# EAGLE design board (EAGLE 9.0.0)
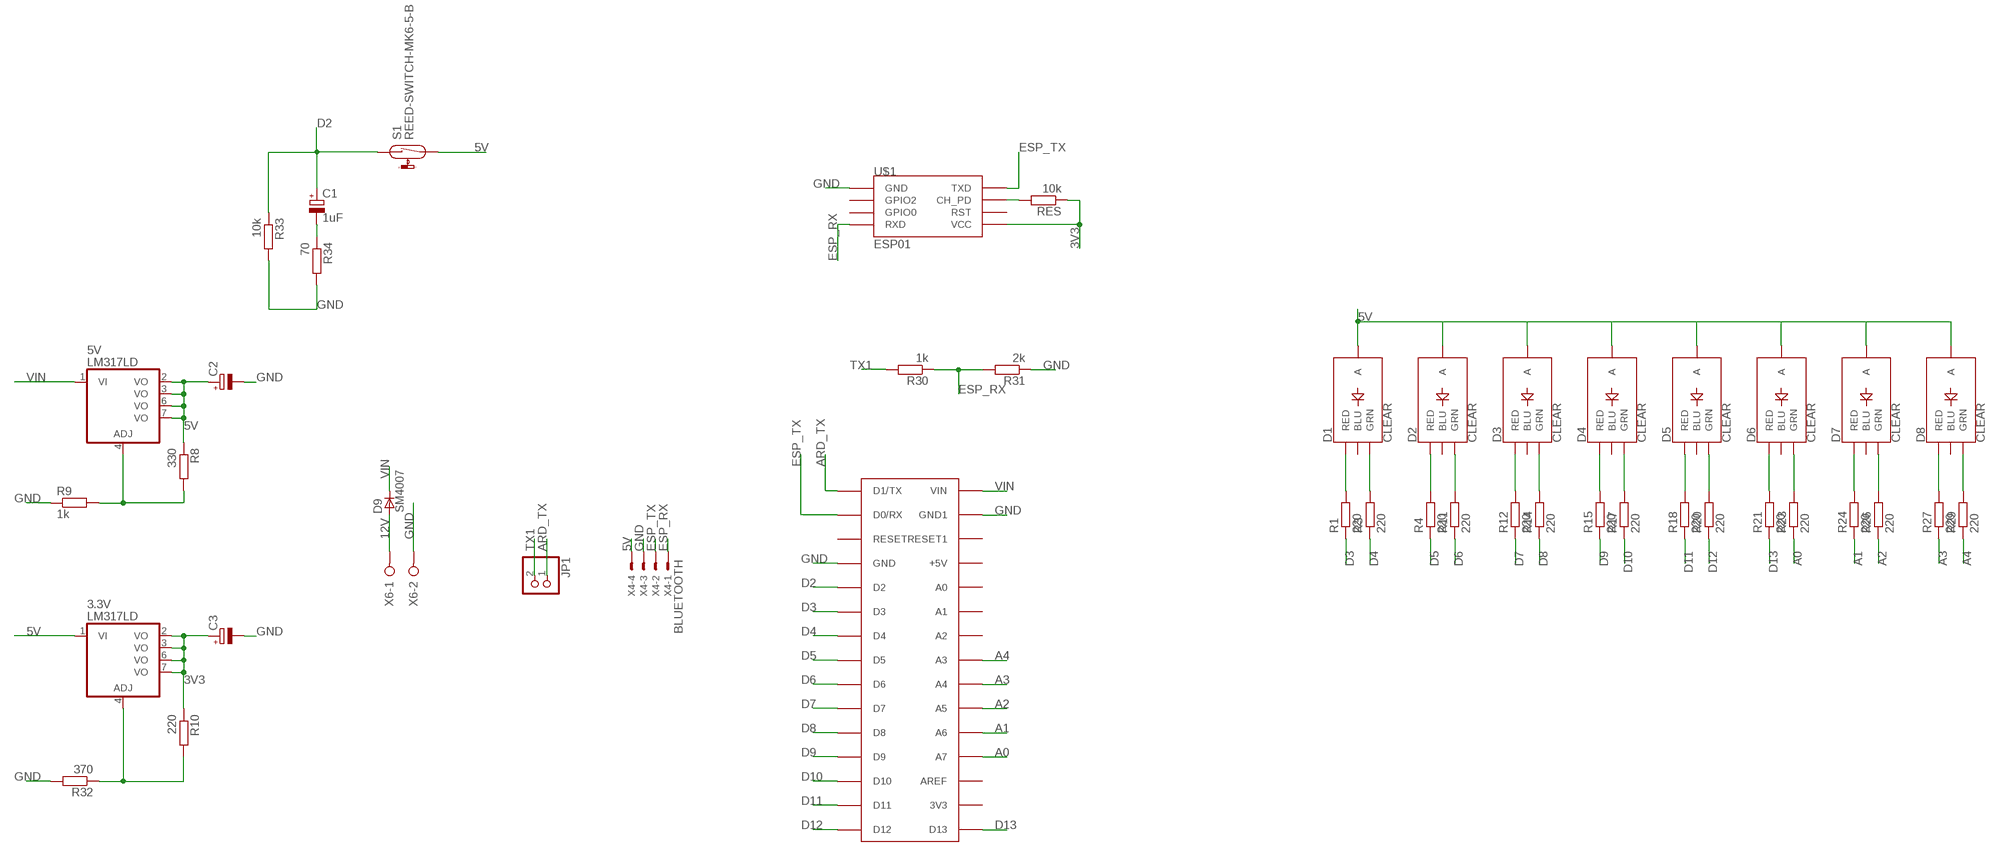
[diagram p0: schematic, sheet 1]

## Parts
3.3V  LM317LD  [SO08]
5V  LM317LD  [SO08]
C1  1uF  CPOL-EUE2-4  [E2-4]
C2  CPOL-EUE2-5  [E2-5]
C3  CPOL-EUE2-5  [E2-5]
D1  CLEAR  LED-RGB-CACLEAR  [LED-RGB-THRU]
D2  CLEAR  LED-RGB-CACLEAR  [LED-RGB-THRU]
D3  CLEAR  LED-RGB-CACLEAR  [LED-RGB-THRU]
D4  CLEAR  LED-RGB-CACLEAR  [LED-RGB-THRU]
D5  CLEAR  LED-RGB-CACLEAR  [LED-RGB-THRU]
D6  CLEAR  LED-RGB-CACLEAR  [LED-RGB-THRU]
D7  CLEAR  LED-RGB-CACLEAR  [LED-RGB-THRU]
D8  CLEAR  LED-RGB-CACLEAR  [LED-RGB-THRU]
D9  SM4007  [MELF-MLL41_DO213AB]
JP1  PINHD-1X2  [1X02]
R1  220  R-EU_R1206  [R1206]
R3  220  R-EU_R1206  [R1206]
R4  220  R-EU_R1206  [R1206]
R8  330  R-EU_R1206  [R1206]
R9  1k  R-EU_R1206  [R1206]
R10  220  R-EU_R1206  [R1206]
R11  220  R-EU_R1206  [R1206]
R12  220  R-EU_R1206  [R1206]
R14  220  R-EU_R1206  [R1206]
R15  220  R-EU_R1206  [R1206]
R17  220  R-EU_R1206  [R1206]
R18  220  R-EU_R1206  [R1206]
R20  220  R-EU_R1206  [R1206]
R21  220  R-EU_R1206  [R1206]
R23  220  R-EU_R1206  [R1206]
R24  220  R-EU_R1206  [R1206]
R26  220  R-EU_R1206  [R1206]
R27  220  R-EU_R1206  [R1206]
R29  220  R-EU_R1206  [R1206]
R30  1k  R-EU_R1206  [R1206]
R31  2k  R-EU_R1206  [R1206]
R32  370  R-EU_R1206  [R1206]
R33  10k  R-EU_R1206  [R1206]
R34  70  R-EU_R1206  [R1206]
RES  10k  R-EU_R1206  [R1206]
S1  REED-SWITCH-MK6-5-B  [MK6-5]
U$1  ESP01  [ESP01]
U$2  ARDUINONANO  [PDIP-32]
X4  BLUETOOTH  22-23-2041  [22-23-2041]
X6  W237-02P  [W237-132]

## Nets
3V3: 3.3V.2(VO) 3.3V.3(VO) 3.3V.6(VO) 3.3V.7(VO) C3.+ R10.1 RES.1 U$1.VCC
5V: 3.3V.1(VI) 5V.2(VO) 5V.3(VO) 5V.6(VO) 5V.7(VO) C2.+ D1.2(A) D2.2(A) D3.2(A) D4.2(A) D5.2(A) D6.2(A) D7.2(A) D8.2(A) R8.1 S1.2 X4.4
12V: D9.A X6.1
A0: R23.1 U$2.A7
A1: R24.1 U$2.A6
A2: R26.1 U$2.A5
A3: R27.1 U$2.A4
A4: R29.1 U$2.A3
ARD_TX: JP1.1 U$2.D1/TX
D2: C1.+ R33.1 S1.1 U$2.D2
D3: R1.1 U$2.D3
D4: R3.1 U$2.D4
D5: R4.1 U$2.D5
D6: R11.1 U$2.D6
D7: R12.1 U$2.D7
D8: R14.1 U$2.D8
D9: R15.1 U$2.D9
D10: R17.1 U$2.D10
D11: R18.1 U$2.D11
D12: R20.1 U$2.D12
D13: R21.1 U$2.D13
ESP_RX: R30.1 R31.2 U$1.RX(RXD) X4.1
ESP_TX: U$1.TX(TXD) U$2.D0/RX X4.2
GND: C2.- C3.- R9.1 R31.1 R32.2 R33.2 R34.2 U$1.GND U$2.GND U$2.GND1 X4.3 X6.2
N$3: C1.- R34.1
N$4: D1.1(RED) R1.2
N$6: RES.2 U$1.CH_PD
N$7: D1.3(GRN) R3.2
N$8: D2.1(RED) R4.2
N$10: D2.3(GRN) R11.2
N$11: D3.1(RED) R12.2
N$13: D3.3(GRN) R14.2
N$14: D4.1(RED) R15.2
N$16: D4.3(GRN) R17.2
N$17: D5.1(RED) R18.2
N$19: D5.3(GRN) R20.2
N$20: D6.1(RED) R21.2
N$22: D6.3(GRN) R23.2
N$23: D7.1(RED) R24.2
N$25: D7.3(GRN) R26.2
N$26: D8.1(RED) R27.2
N$28: D8.3(GRN) R29.2
N$30: 5V.4(ADJ) R8.2 R9.2
N$31: 3.3V.4(ADJ) R10.2 R32.1
TX1: JP1.2 R30.2
VIN: 5V.1(VI) D9.C U$2.VIN
Unconnected: D1.4(BLU) D2.4(BLU) D3.4(BLU) D4.4(BLU) D5.4(BLU) D6.4(BLU) D7.4(BLU) D8.4(BLU) U$1.GPIO0 U$1.GPIO2 U$1.RST U$2.3V3 U$2.+5V U$2.A0 U$2.A1 U$2.A2 U$2.AREF U$2.RESET U$2.RESET1

## Library data of the parts
3.3V 5V = linear:LM317LD: LOW CURRENT 1.2 TO 37V ADJUSTABLE VOLTAGE REGULATOR Source: http://pdf.alldatasheet.com
C1 = rcl:CPOL-EU: POLARIZED CAPACITOR, European symbol
C2 C3 = rcl:CPOL-EU: POLARIZED CAPACITOR, European symbol; SPICEPREFIX: C
D1-D8 = SparkFun-LED:LED-RGB-CA: LED-RGB Diffused Common Anode Packages: LED RGB-THRU P-LCC-4-3 LED-TRICOLOR-SMD SparkFun Products: RGB Diffused Common Anode- Diffuse <[https://www.sparkfun.com/products/10821]> RGB Diffused Common Anode - Clear <[https://www.sparkfun.com/products/10820]> Qduino Mini <[https://www.sparkfun.com/products/13614]> Triple Output LED RGB - SMD <https://www.sparkfun.com/products/7844>; PROD_ID: DIO-10631
D9 = _hhn_diodes_smd:SM400*: SM4001 .. SM4007 General Purpose Rectifier, 1 A SMD-Version of 1N4001 .. 1N4007 Case: MELF-MLL41 = DO 213 AB Author: Dipl.-Ing. FH Rainer Bayer HHN Hochschule Heilbronn, rainer.bayer@hs-heilbronn.de Ingenieurbüro ing-rb, mail@ing-rb.de
JP1 = pinhead:PINHD-1X2: PIN HEADER
R1 R3 R4 R8-R12 R14 R15 R17 R18 R20 R21 R23 R24 R26 R27 R29-R34 RES = rcl:R-EU_: RESISTOR, European symbol; SPICEPREFIX: R
S1 = switch-reed:REED-SWITCH-: Reed Sensor; MF: MEDER; MPN: MK6-5-B; OC_FARNELL: 1079479
U$1 = esp8266modules:ESP01: ESP8266 Wifi module 01
U$2 = jet-lib:ARDUINONANO
X4 = con-molex:22-23-2041: .100" (2.54mm) Center Header - 4 Pin; MF: MOLEX; MPN: 22-23-2041; OC_FARNELL: 1462920; OC_NEWARK: 38C0355
X6 = con-wago-508:W237-02P: WAGO SREW CLAMP; OC_FARNELL: unknown; OC_NEWARK: unknown

## Net classes
0 default: width 0.635 mm, clearance 0.508 mm

## Board
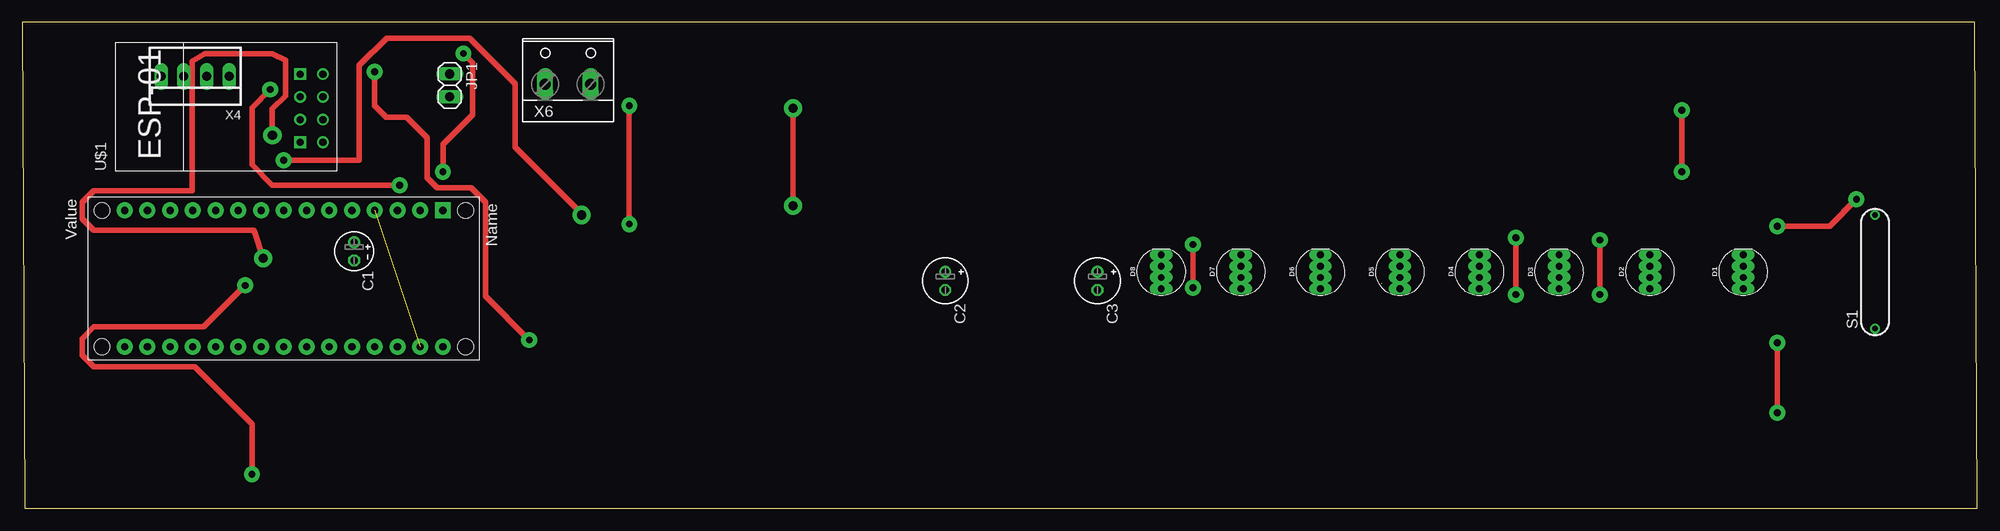
[diagram p1: board, top side]
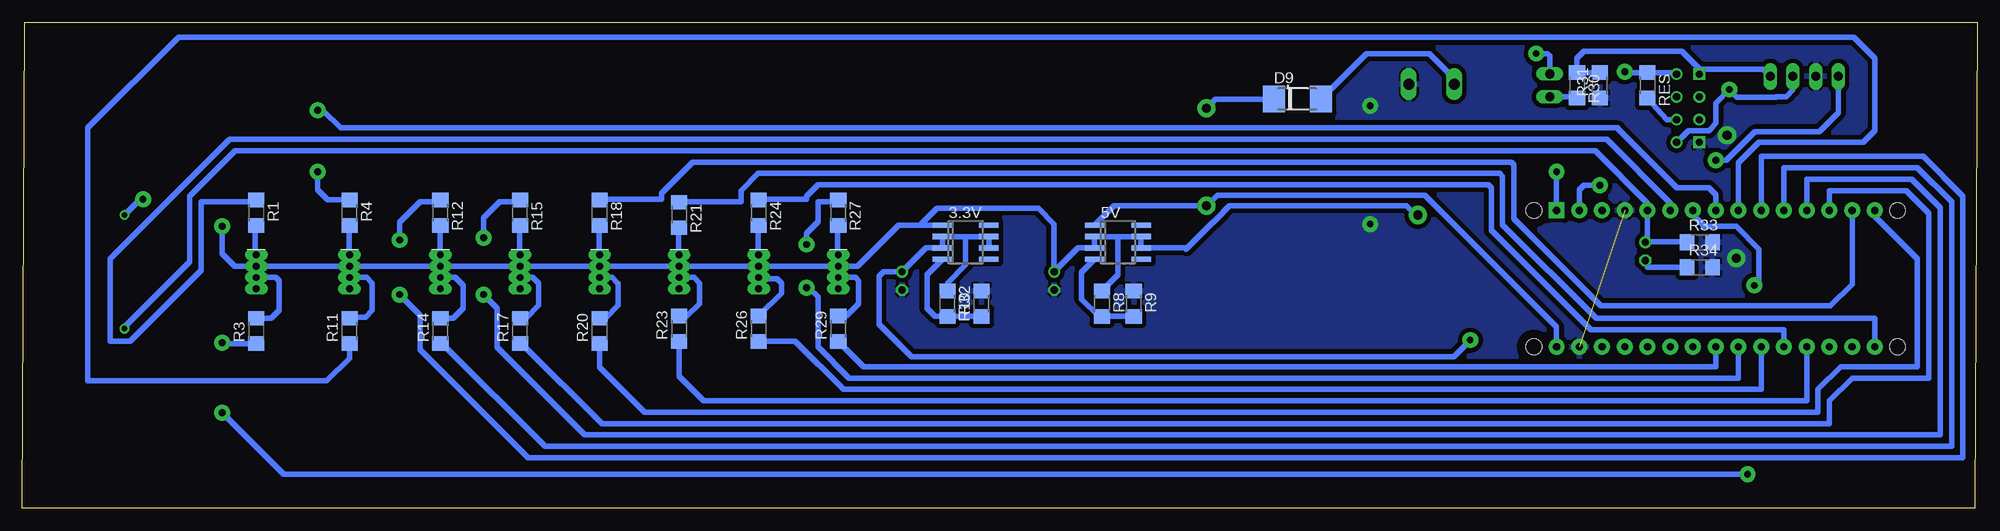
[diagram p2: board, bottom side, seen from below]

Size 218.42 x 54.28 mm. Coordinates in mm from the lower left corner, seen from the top.
Outline: 0.25,0 218.42,0 218.17,54.28 0,54.28 0.25,0
Copper layers (1*16): Top 0.035mm / dielectric 1.5mm / Bottom 0.035mm
Design rules "default": minimum track width 10mil, minimum drill 24mil, track to track 8mil, track to pad 8mil, pad to pad 8mil, via to via 8mil, smd to smd 8mil, copper to edge 40mil, drill to drill 8mil, minimum pad ring 10mil, minimum via ring 8mil, stop-mask expansion 4mil, vias tented up to drill 0mil, thermal gap 10mil

### Footprints (pad centres in the part's own frame; a part is rotated, then mirrored left to right if it is on the bottom)
SO08 = smd 0.6 x 2.2: 1 -1.905,-2.6; 2 -0.635,-2.6; 3 0.635,-2.6; 4 1.905,-2.6; 5 1.905,2.6; 6 0.635,2.6; 7 -0.635,2.6; 8 -1.905,2.6
E2-4 = drill 0.813 pad 1.27: + -1.016,0 | drill 0.813 pad 1.27 octagon: - 1.016,0
E2-5 = drill 0.813 pad 1.27: + -1.016,0 | drill 0.813 pad 1.27 octagon: - 1.016,0
LED-RGB-THRU = drill 0.762 pad 0.889 long: 1 1.905,0; 2 0.635,0; 3 -0.635,0; 4 -1.905,0
MELF-MLL41_DO213AB = smd 2.5 x 3: A 2.625,0; C -2.625,0
1X02 = drill 1.016 long: 1 -1.27,0; 2 1.27,0
R1206 = smd 1.6 x 1.803: 1 -1.422,0; 2 1.422,0
MK6-5 = drill 0.6 pad 1.016: 1 -6.35,0; 2 6.35,0
ESP01 = drill 0.8: CH_PD -1.285,-8.178; GPIO0 1.255,-5.638; GPIO2 -1.285,-5.638; RST 1.255,-8.178; TX -3.825,-8.178; VCC 3.795,-8.178 | drill 0.8 square: GND -3.825,-5.638; RX 3.795,-5.638
PDIP-32 = drill 0.8 pad 1.778: 3V3 15.24,-35.56; +5V 15.24,-10.16; A0 15.24,-12.7; A1 15.24,-15.24; A2 15.24,-17.78; A3 15.24,-20.32; A4 15.24,-22.86; A5 15.24,-25.4; A6 15.24,-27.94; A7 15.24,-30.48; AREF 15.24,-33.02; D0/RX 0,-5.08; D2 0,-12.7; D3 0,-15.24; D4 0,-17.78; D5 0,-20.32; D6 0,-22.86; D7 0,-25.4; D8 0,-27.94; D9 0,-30.48; D10 0,-33.02; D11 0,-35.56; D12 0,-38.1; D13 15.24,-38.1; GND 0,-10.16; GND1 15.24,-5.08; RESET 0,-7.62; RESET1 15.24,-7.62; VIN 15.24,-2.54 | drill 0.8 pad 1.778 square: D1/TX 0,-2.54 | hole 1.778: 0,0; 0,-40.64; 15.24,-40.64; 15.24,0
22-23-2041 = drill 1 long: 1 -3.81,0; 2 -1.27,0; 3 1.27,0; 4 3.81,0
W237-132 = drill 1.194 long: 1 -2.54,-0.635; 2 2.54,-0.635

### Placement (x,y rotation side)
3.3V  113.03,29.72 270 bottom
5V  96.01,29.72 270 bottom
C1  37.08,28.7 270 top
C2  103.12,25.4 270 top
C3  120.14,25.4 270 top
D1  192.28,26.42 90 top
D2  181.86,26.42 90 top
D3  171.7,26.42 90 top
D4  162.81,26.42 90 top
D5  153.92,26.42 90 top
D6  145.03,26.42 90 top
D7  136.14,26.42 90 top
D8  127.25,26.42 90 top
D9  75.95,45.72 0 bottom
JP1  47.75,47.24 270 top
R1  192.28,33.02 270 bottom
R3  192.28,19.81 90 bottom
R4  181.86,33.02 270 bottom
R8  97.79,22.86 270 bottom
R9  94.23,22.86 270 bottom
R10  115.06,22.86 270 bottom
R11  181.86,19.81 90 bottom
R12  171.7,33.02 270 bottom
R14  171.7,19.81 90 bottom
R15  162.81,33.02 270 bottom
R17  162.81,19.81 90 bottom
R18  153.92,33.02 270 bottom
R20  153.92,19.81 90 bottom
R21  145.03,32.77 270 bottom
R23  145.03,20.07 90 bottom
R24  136.14,33.02 270 bottom
R26  136.14,20.07 90 bottom
R27  127.25,33.02 270 bottom
R29  127.25,20.07 90 bottom
R30  44.7,47.24 270 bottom
R31  42.16,47.24 90 bottom
R32  111.25,22.86 90 bottom
R33  30.99,29.72 0 bottom
R34  30.99,26.92 0 bottom
RES  36.83,47.24 270 bottom
S1  207.01,26.42 90 top
U$1  25.4,44.7 90 top
U$2  49.53,33.27 270 top
X4  19.3,48.26 180 top
X6  60.96,48.01 0 top

### Tracks (layer width: path | path; a pad name or v marks a point on that pad's centre or on a via)
3V3  (via drill 0.76 pad 1.78)
  Top 0.635: v56.64,18.8 51.75,23.69 51.75,34.19 50.13,35.81 46.34,35.81 45.21,36.94 45.21,41.4 42.93,43.69 40.64,43.69 39.37,44.96 v39.37,48.77
  Bottom 0.635: R10.1 115.06,25.15 113.03,27.18 113.03,30.23 112.9,30.35 | 112.9,30.35 3.3V.7 3.3V.6 | 112.9,30.35 3.3V.2 3.3V.3 117.47,29.08 C3.+ 122.17,26.42 122.68,25.91 122.68,20.57 119.06,16.95 58.48,16.95 v56.64,18.8 | U$1.VCC 33.75,48.67 RES.1 39.27,48.67 v39.37,48.77
5V  (via drill 0.76 pad 1.78, 1.02 pad 2.03)
  Top 0.635: v204.94,34.51 201.93,31.5 v196.09,31.5 | v29.21,38.86 37.66,38.86 37.66,49.48 40.69,52.51 49.99,52.51 55.06,47.44 55.06,40.3 62.48,32.88 v62.48,32.77
  Bottom 0.635: 118.11,31.62 120.52,31.62 125.09,27.05 D8.2 D7.2 D6.2 D5.2 D4.2 D3.2 D2.2 D1.2 194.69,27.05 196.09,28.45 v196.09,31.5 | 118.11,31.62 3.3V.1 | 96.01,30.35 5V.2 5V.3 100.46,29.08 C2.+ 103.12,31.75 104.9,33.53 116.2,33.53 118.11,31.62 | 96.01,30.35 5V.7 5V.6 88.52,29.08 88.39,28.96 85.41,31.94 85.34,31.94 84.27,33.02 84.27,33.08 83.57,33.78 63.75,33.78 62.74,32.77 v62.48,32.77 | R8.1 96.01,26.06 96.01,30.35 | S1.2 204.98,34.8 204.94,34.76 v204.94,34.51 | X4.4 15.49,44.2 17.65,42.04 24.86,42.04 28.03,38.86 v29.21,38.86
12V
  Bottom 0.635: D9.A 68.24,50.8 61.21,50.8 58.42,48.01 X6.1
A0
  Bottom 0.635: U$2.A7 19.05,12 132.4,12 142.3,12 145.03,14.73 R23.1 144.78,18.35
A1
  Bottom 0.635: U$2.A6 21.59,19.94 43.18,19.94 54.29,31.05 54.29,35.81 54.61,36.13 129.54,36.13 130.81,34.86 130.81,34.54 135.89,34.54 R24.1
A2
  Bottom 0.635: U$2.A5 24.13,13.27 126.68,13.27 132.06,18.64 R26.1
A3  (via drill 0.76 pad 1.78)
  Top 0.635: v130.81,24.64 v130.81,29.46
  Bottom 0.635: U$2.A4 26.67,14.54 126.05,14.54 129.54,18.03 129.54,23.62 130.56,24.64 v130.81,24.64 | R27.1 127.32,34.23 129.54,34.23 129.54,32 130.81,30.73 v130.81,29.46
A4
  Bottom 0.635: U$2.A3 29.21,15.81 124.45,15.81 127.08,18.44 | 127,18.35 127.08,18.44 | 127.08,18.44 R29.1
ARD_TX  (via drill 0.76 pad 1.78)
  Top 0.635: v46.99,37.59 46.99,40.64 50.29,43.94 50.29,49.78 v49.28,50.8
  Bottom 0.635: U$2.D1/TX v46.99,37.59 | v49.28,50.8 48.01,50.8 47.75,50.55 JP1.1
D2
  Bottom 0.635: R33.1 32.7,29.78 36.83,29.78 C1.+ 36.83,30.1 U$2.D2 36.83,34.1 42.67,39.94 194.63,39.94 199.71,34.86 199.71,27.56 207.01,20.26 S1.1
D3
  Bottom 0.635: R1.1 192.41,34.23 198.44,34.23 198.44,26.61 206.38,18.67 208.6,18.67 208.6,27.88 195.26,41.21 41.4,41.21 34.29,34.1 U$2.D3
D4  (via drill 0.76 pad 1.78)
  Top 0.635: v24.89,24.89 20.26,20.26 7.97,20.26 6.67,18.96 6.67,17.11 7.97,15.81 19.24,15.81 25.65,9.4 v25.65,3.81 | v196.09,10.67 v196.09,18.48
  Bottom 0.635: U$2.D4 31.75,32.77 30.48,31.5 26.92,31.5 24.38,28.96 24.38,25.4 v24.89,24.89 | v25.65,3.81 189.23,3.81 v196.09,10.67 | v196.09,18.48 196,18.39 R3.1
D5  (via drill 0.76 pad 1.78)
  Top 0.635: v185.42,37.59 v185.42,44.45
  Bottom 0.635: 181.93,34.23 R4.1 184.3,34.44 185.42,35.56 v185.42,37.59 | U$2.D5 29.21,35.05 29.97,35.81 33.53,35.81 40.13,42.42 40.13,42.48 182.88,42.48 184.85,44.45 v185.42,44.45
D6
  Bottom 0.635: R11.1 181.86,16.76 184.4,14.22 211.14,14.22 211.14,42.48 200.98,52.64 13.78,52.64 11.43,50.29 11.43,42.16 12.7,40.89 24.38,40.89 26.67,38.61 U$2.D6
D7  (via drill 0.76 pad 1.78)
  Top 0.635: v176.28,23.88 v176.28,29.97
  Bottom 0.635: U$2.D7 24.13,39.31 6.03,39.31 1.59,34.86 1.59,5.65 161.93,5.65 173.99,17.72 173.99,21.59 v176.28,23.88 | R12.1 171.77,34.23 173.99,34.23 176.28,31.94 v176.28,29.97
D8
  Bottom 0.635: U$2.D8 21.59,38.04 6.67,38.04 2.86,34.23 2.86,6.92 160.02,6.92 171.45,18.35 R14.1
D9  (via drill 0.76 pad 1.78)
  Top 0.635: v166.88,23.88 v166.88,30.23
  Bottom 0.635: U$2.D9 19.05,36.77 7.3,36.77 4.13,33.59 4.13,8.19 155.57,8.19 165.35,17.97 165.35,22.35 v166.88,23.88 | R15.1 162.88,34.23 165.1,34.23 166.88,32.45 v166.88,30.23
D10
  Bottom 0.635: U$2.D10 16.51,35.5 7.94,35.5 5.4,32.96 5.4,14.54 13.97,14.54 16.51,12 16.51,9.46 153.67,9.46 162.56,18.35 R17.1
D11
  Bottom 0.635: U$2.D11 13.97,25.02 16.38,22.61 42.04,22.61 51.75,32.32 51.75,38.35 52.07,38.67 143.51,38.67 147,35.18 147,34.54 153.67,34.54 R18.1
D12
  Bottom 0.635: U$2.D12 11.43,32.64 6.67,27.88 6.67,15.81 15.24,15.81 17.78,13.27 17.78,10.73 148.91,10.73 153.92,15.75 R20.1
D13
  Bottom 0.635: U$2.D13 11.43,21.21 42.55,21.21 53.02,31.69 53.02,37.08 53.34,37.4 136.21,37.4 138.11,35.5 138.11,34.23 144.78,34.23 R21.1
ESP_RX
  Bottom 0.635: 30.99,49.02 33.02,51.05 43.94,51.05 44.7,50.29 R30.1 R31.2 | 30.99,49.02 31.04,48.97 U$1.RX | X4.1 23.88,49.02 30.99,49.02
ESP_TX  (via drill 0.76 pad 1.78)  (1 unrouted)
  Top 0.635: v42.16,36.07 27.94,36.07 25.65,38.35 25.65,44.75 v27.69,46.78
  Bottom 0.635: 33.54,40.88 32.26,42.16 29.97,42.16 29.91,42.23 29.78,42.35 29.78,42.42 29.21,42.99 29.21,45.26 v27.69,46.78 26.83,45.93 22.46,45.93 22.41,45.97 21.34,45.97 20.57,46.74 X4.2 | v42.16,36.07 43.94,36.07 44.45,35.56 U$2.D0/RX
GND  (via drill 0.76 pad 1.78, 1.02 pad 2.03)  (1 unrouted)
  Top 0.635: v67.82,44.96 v67.82,31.75 | v26.92,27.94 25.91,30.99 25.84,31.05 7.97,31.05 6.67,32.35 6.67,34.19 7.97,35.5 19,35.5 19,49.92 20.37,50.78 27.89,50.78 29.4,50.03 29.4,46.07 27.94,44.61 v27.94,41.66
  pour Bottom: 0.76,53.34 0.76,1.02 218.19,0.51 218.19,53.34
N$3
  Bottom 0.635: R34.1 36.83,26.92 36.83,27.56 C1.-
N$4
  Bottom 0.635: R1.2 192.41,31.37 192.41,28.51 D1.1
N$6
  Bottom 0.635: RES.2 34.68,43.42 U$1.CH_PD
N$7
  Bottom 0.635: D1.3 190.12,25.78 189.74,25.4 189.74,22.1 190.6,21.23 R3.2
N$8
  Bottom 0.635: R4.2 181.93,31.37 181.93,28.51 D2.1
N$10
  Bottom 0.635: D2.3 179.96,25.78 179.32,25.15 179.32,22.1 180.09,21.34 181.76,21.34 R11.2
N$11
  Bottom 0.635: R12.2 171.77,31.37 171.77,28.51 D3.1
N$13
  Bottom 0.635: D3.3 170.05,25.78 169.16,24.89 169.16,22.35 170.28,21.23 R14.2
N$14
  Bottom 0.635: R15.2 162.88,31.37 162.88,28.51 D4.1
N$16
  Bottom 0.635: R17.2 162.15,21.23 160.72,22.67 160.72,25.12 161.38,25.78 D4.3
N$17
  Bottom 0.635: R18.2 153.99,31.37 153.99,28.51 D5.1
N$19  (1 unrouted)
  Bottom 0.635: D5.3 152.53,25.78 151.89,25.15 | R20.2 153.26,21.23 151.83,22.67 151.83,25.12 151.88,25.16
N$20
  Bottom 0.635: R21.2 145.1,31.05 145.1,28.51 D6.1
N$22
  Bottom 0.635: D6.3 143.38,25.78 142.75,25.15 142.75,22.86 144.12,21.49 R23.2
N$23
  Bottom 0.635: R24.2 136.21,31.37 136.21,28.51 D7.1
N$25
  Bottom 0.635: R26.2 133.6,24.03 133.6,25.15 134.11,25.65 136.02,25.65 D7.3
N$26
  Bottom 0.635: R27.2 127.32,31.37 127.32,28.51 D8.1
N$28
  Bottom 0.635: D8.3 125.35,25.78 124.97,25.4 124.97,22.86 126.34,21.49 R29.2
N$30
  Bottom 0.635: 5V.4 100.08,26.35 100.08,23.37 98.15,21.44 R8.2 R9.2
N$31
  Bottom 0.635: 3.3V.4 117.35,26.1 117.35,22.35 116.43,21.44 R10.2 | R32.1 R10.2 | R10.2 115.16,21.34
TX1
  Bottom 0.635: R30.2 44.86,45.97 JP1.2
VIN  (via drill 1.02 pad 2.03)
  Top 0.635: v86.11,44.7 v86.11,33.78
  Bottom 0.635: D9.C 85.09,45.72 v86.11,44.7 | 5V.1 96.45,33.78 v86.11,33.78 84.9,34.99 61.72,34.99 46.99,20.26 U$2.VIN